# EAGLE design Pi1541_Rot (EAGLE 9.2.2)
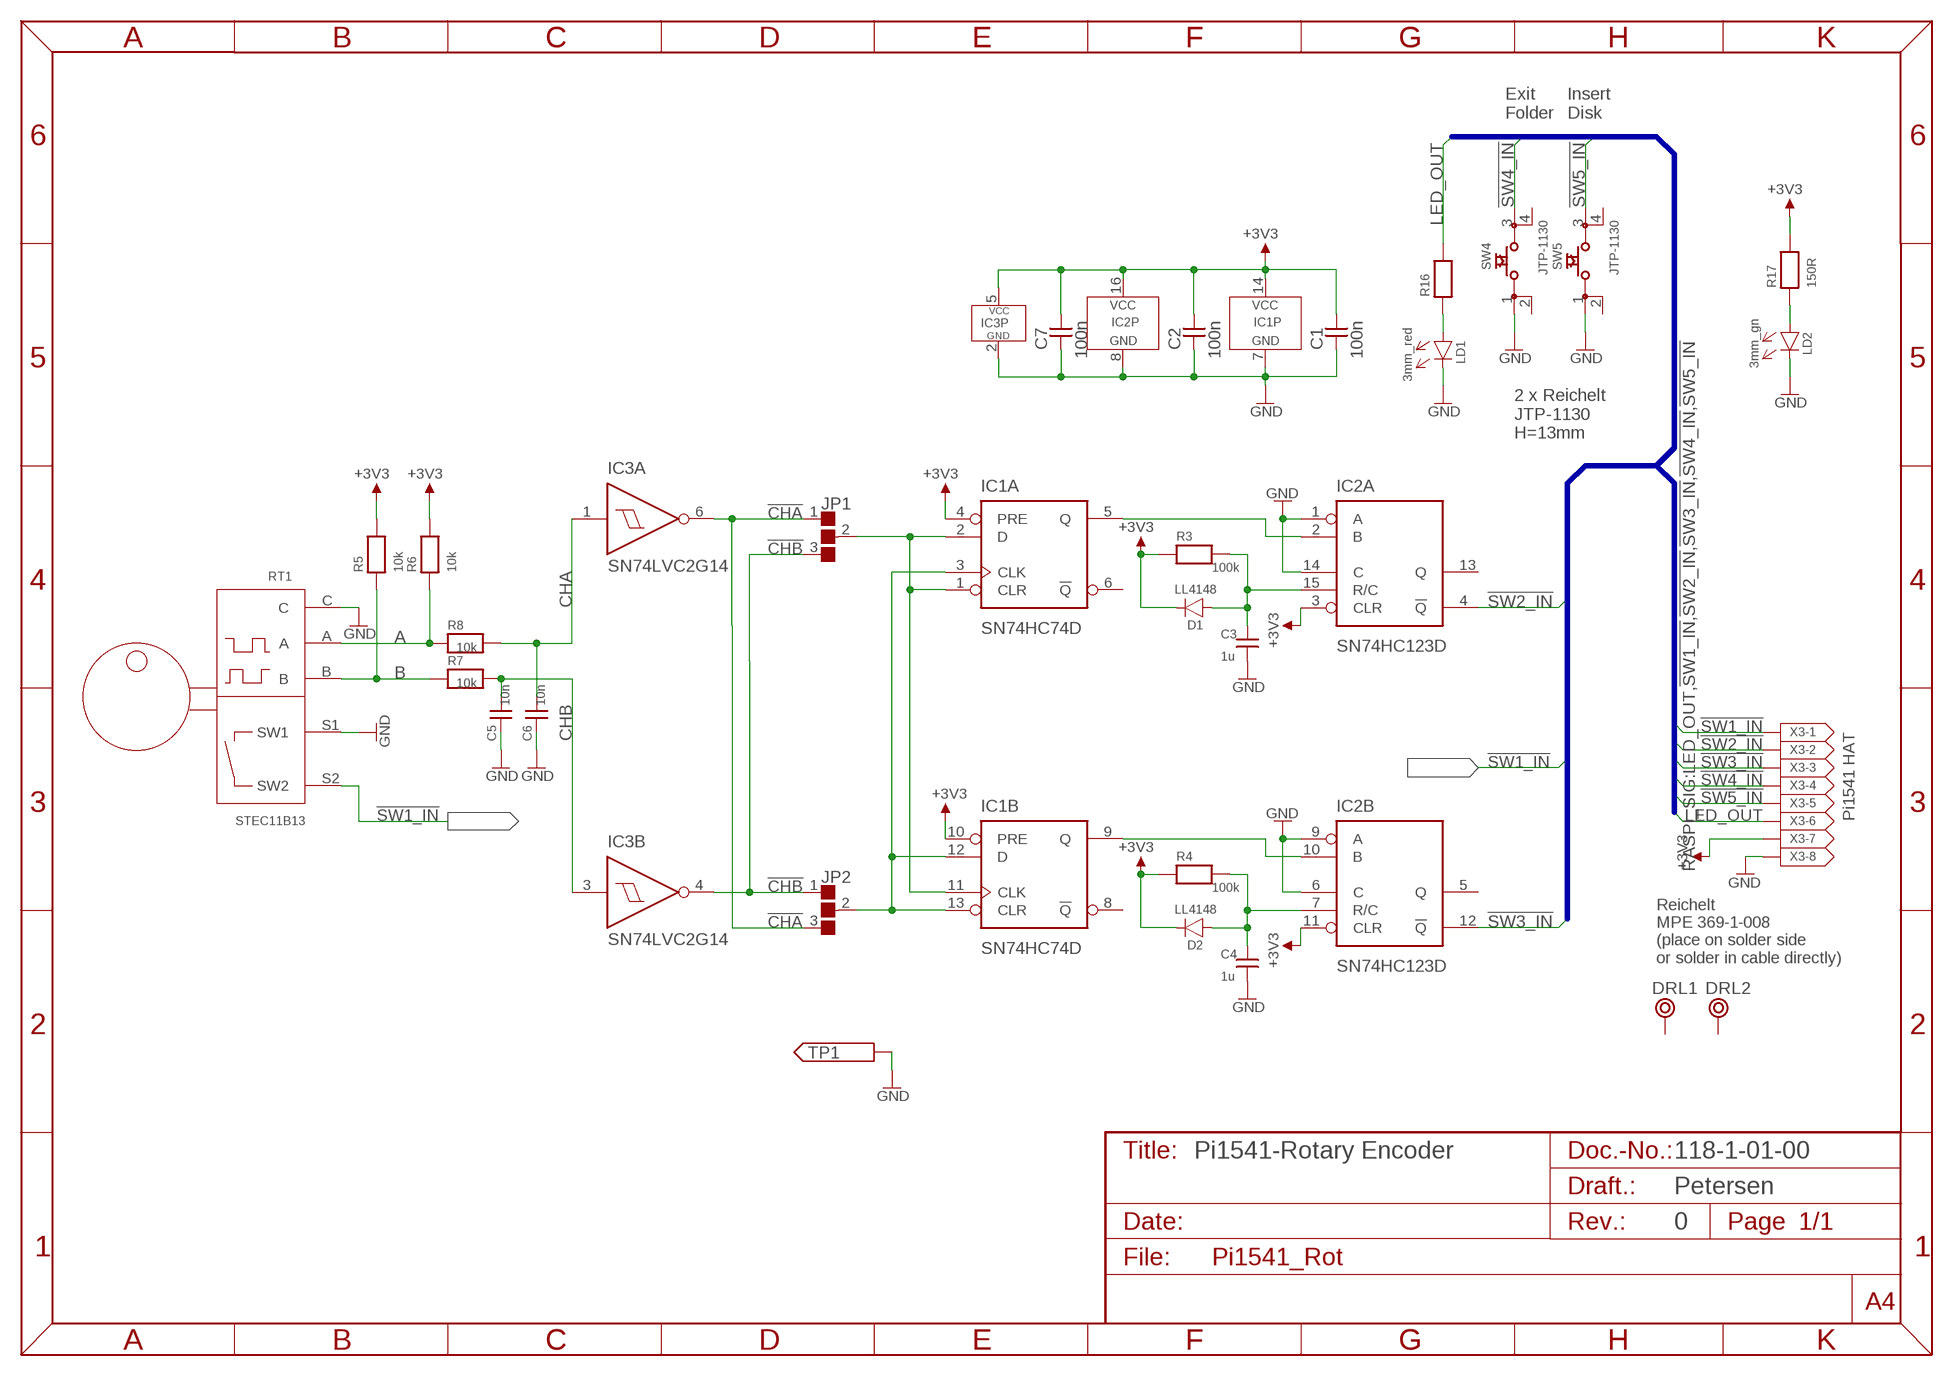
[diagram p0: schematic, sheet 1]
U$20 (OUT): SPICEPREFIX: X

## Parts
C1  100n  C-0805  [0805]
C2  100n  C-0805  [0805]
C3  1u  C-0805  [0805]
C4  1u  C-0805  [0805]
C5  10n  C-0805  [0805]
C6  10n  C-0805  [0805]
C7  100n  C-0805  [0805]
D1  LL4148  [SOD80C]
D2  LL4148  [SOD80C]
DRL1  BOHR2,8  [BOHR2,8_]
DRL2  BOHR2,8  [BOHR2,8_]
IC1  SN74HC74D  7474HC  [SO-14]
IC2  SN74HC123D  74123  [SO-16]
IC3  SN74LVC2G14  [SOT23-6]
JP1  JMP_0603  [CP3P]
JP2  JMP_0603  [CP3P]
LD1  3mm_red  3MM  [3MM]
LD2  3mm_gn  3MM  [3MM]
R3  100k  R-0805  [0805]
R4  100k  R-0805  [0805]
R5  10k  R-0805  [0805]
R6  10k  R-0805  [0805]
R7  10k  R-0805  [0805]
R8  10k  R-0805  [0805]
R16  150R  R-0805  [0805]
R17  150R  R-0805  [0805]
RT1  STEC11B13  [STEC11B13]
SW4  JTP-1130  [JTP-1130]
SW5  JTP-1130  [JTP-1130]
TP1  PAD1,0/AUTO  [1.0/AUTO]
X3  MICMA08B  [MICMA08B]

## Nets
!CHA: IC3.6(A:O) JP1.1 JP2.3
!CHB: IC3.4(B:O) JP1.3 JP2.1
!SW1_IN: RT1.S2(SW2) X3.1
!SW2_IN: IC2.4(A:!Q) X3.2
!SW3_IN: IC2.12(B:!Q) X3.3
!SW4_IN: SW4.3 X3.4
!SW5_IN: SW5.3 X3.5
+3V3: C1.2 C2.2 C7.2 D1.K D2.K IC1.4(A:PRE) IC1.10(B:PRE) IC1.14(P:VCC) IC2.3(A:CLR) IC2.11(B:CLR) IC2.16(P:VCC) IC3.5(P:VCC) R3.1 R4.1 R5.2 R6.2 R17.2 X3.7
A: R6.1 R8.1 RT1.A
B: R5.1 R7.1 RT1.B
CHA: C6.2 IC3.1(A:I) R8.2
CHB: C5.2 IC3.3(B:I) R7.2
GND: C1.1 C2.1 C3.2 C4.2 C5.1 C6.1 C7.1 IC1.7(P:GND) IC2.1(A:A) IC2.6(B:C) IC2.8(P:GND) IC2.9(B:A) IC2.14(A:C) IC3.2(P:GND) LD1.C(K) LD2.C(K) RT1.C RT1.S1(SW1) SW4.1 SW5.1 TP1.1 X3.8
LED_OUT: R16.2 X3.6
N$1: IC1.5(A:Q) IC2.2(A:B)
N$2: IC1.9(B:Q) IC2.10(B:B)
N$3: IC1.1(A:CLR) IC1.2(A:D) IC1.11(B:CLK) JP1.2
N$4: C3.1 D1.A IC2.15(A:R/C) R3.2
N$5: C4.1 D2.A IC2.7(B:R/C) R4.2
N$6: IC1.3(A:CLK) IC1.12(B:D) IC1.13(B:CLR) JP2.2
N$7: LD2.A R17.1
N$12: LD1.A R16.1
Unconnected: DRL1.MH DRL2.MH IC1.6(A:!Q) IC1.8(B:!Q) IC2.5(B:Q) IC2.13(A:Q) SW4.2 SW4.4 SW5.2 SW5.4

## Buses
RASPI_SIG:LED_OUT,!SW1_IN,!SW2_IN,!SW3_IN,!SW4_IN,!SW5_IN

## Notes on the sheet
- Exit
  Folder
- Insert
  Disk
- 2 x Reichelt
  JTP-1130
  H=13mm
- Pi1541 HAT
- Reichelt
  MPE 369-1-008
  (place on solder side
  or solder in cable directly)
- Pi1541-Rotary Encoder | 118-1-01-00
- Petersen
- 0

## Library data of the parts
C1-C7 = SMD:C-0805
D1 D2 = Dioden:LL4148
DRL1 DRL2 = Mech_Bohr:BOHR2,8
IC1 = 74XX:7474*: Dual D-Flip-Flop SO14
IC2 = 74XX:74123
IC3 = Texas_Instruments:SN74LVC2G14
JP1 JP2 = Cutpad:JMP_0603
LD1 LD2 = LED:3MM
R3-R8 R16 R17 = SMD:R-0805
RT1 = Alps:STEC11B13
SW4 SW5 = Namae_Electronics:JTP-1130
TP1 = Pads:PAD1,0/AUTO
X3 = AMP:MICMA08B

## Board
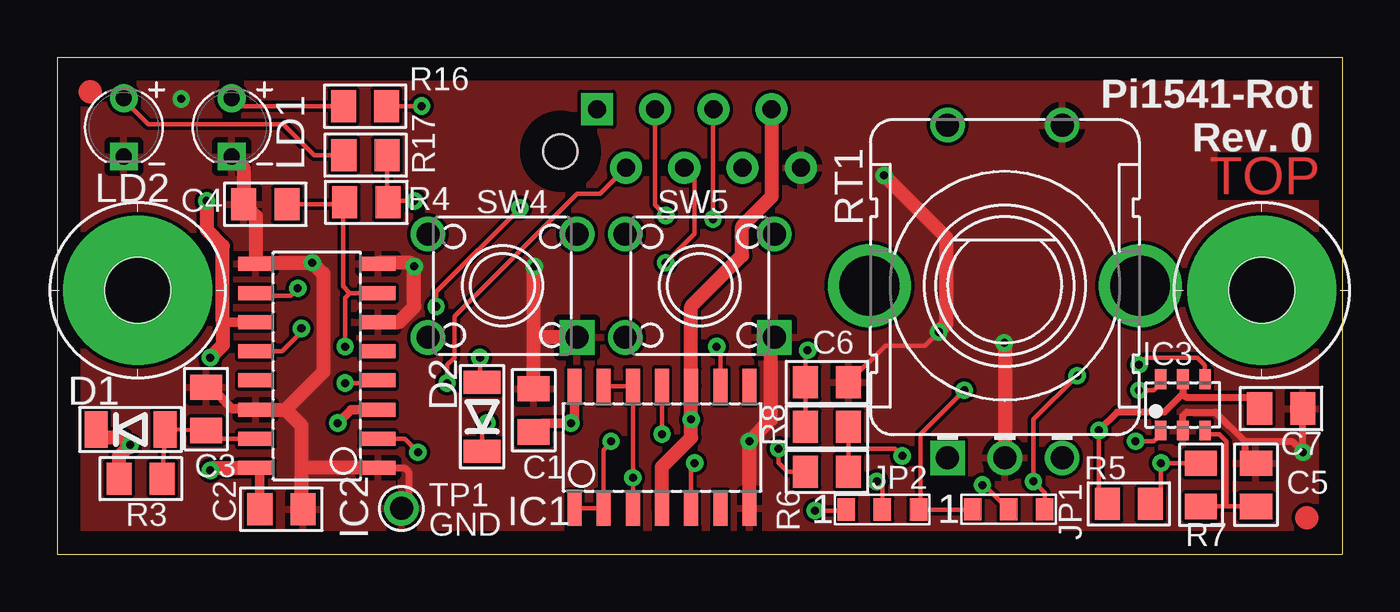
[diagram p1: board, top side]
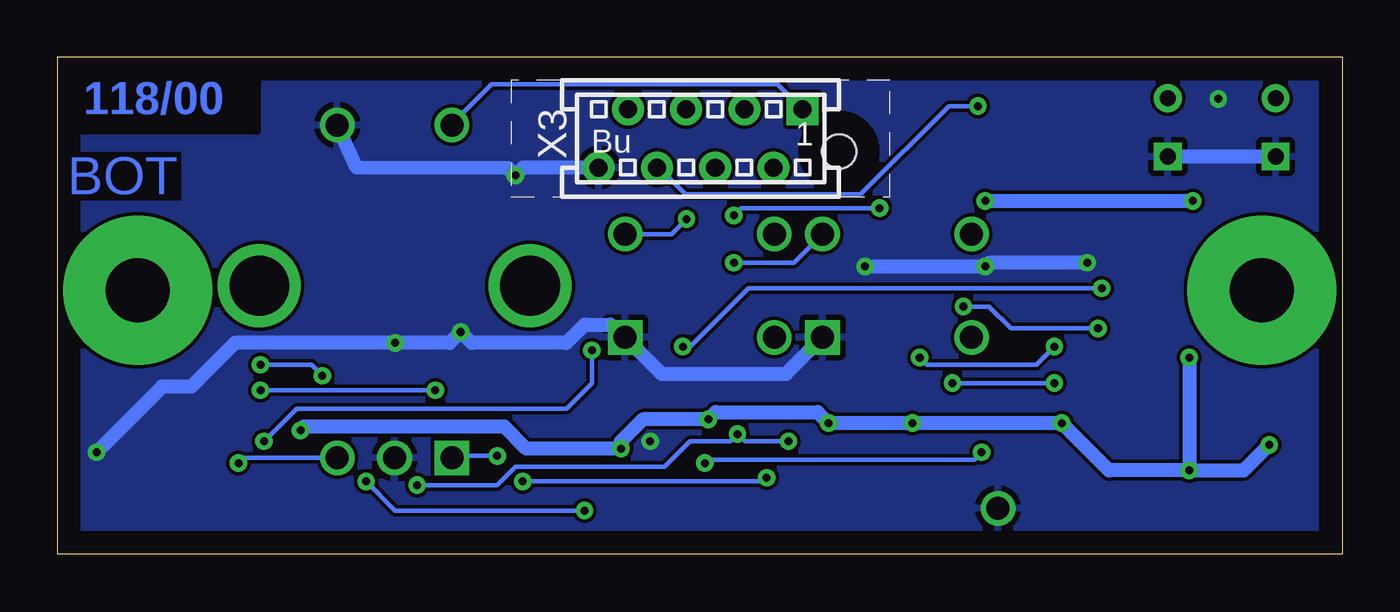
[diagram p2: board, bottom side, seen from below]

Size 56 x 21.65 mm. Coordinates in mm from the lower left corner, seen from the top.
Outline: 0,0 56,0 56,21.65 0,21.65 0,0
Copper layers (1*16): Top 0.035mm / dielectric 1.5mm / Bottom 0.035mm
Design rules "default *": minimum track width 6mil, minimum drill 0.35mm, track to track 6mil, track to pad 6mil, pad to pad 6mil, via to via 6mil, smd to smd 6mil, copper to edge 40mil, drill to drill 6mil, minimum pad ring 10mil, minimum via ring 8mil, stop-mask expansion 4mil, vias tented up to drill 0.5mm, thermal gap 10mil
bRestrict: 2 lines

### Footprints (pad centres in the part's own frame; a part is rotated, then mirrored left to right if it is on the bottom)
0805 = smd 1.092 x 1.397: 1 -0.94,0; 2 0.94,0
SOD80C = smd 1 x 1.6: A -1.5,0; K 1.5,0
BOHR2,8_ = drill 2.794 pad 6.502: MH 0,0
SO-14 = smd 0.61 x 1.524: 1 -3.81,-2.667; 2 -2.54,-2.667; 3 -1.27,-2.667; 4 0,-2.667; 5 1.27,-2.667; 6 2.54,-2.667; 7 3.81,-2.667; 8 3.81,2.667; 9 2.54,2.667; 10 1.27,2.667; 11 0,2.667; 12 -1.27,2.667; 13 -2.54,2.667; 14 -3.81,2.667
SO-16 = smd 0.61 x 1.524: 1 -4.445,-2.667; 2 -3.175,-2.667; 3 -1.905,-2.667; 4 -0.635,-2.667; 5 0.635,-2.667; 6 1.905,-2.667; 7 3.175,-2.667; 8 4.445,-2.667; 9 4.445,2.667; 10 3.175,2.667; 11 1.905,2.667; 12 0.635,2.667; 13 -0.635,2.667; 14 -1.905,2.667; 15 -3.175,2.667; 16 -4.445,2.667
SOT23-6 = smd 0.508 x 0.864: 1 -0.965,-1.118; 2 0,-1.118; 3 0.965,-1.118; 4 0.965,1.118; 5 0,1.118; 6 -0.965,1.118
CP3P = smd 0.762 x 0.965: 1 -1.575,0; 2 0,0; 3 1.575,0
3MM = drill 0.7: A -1.27,0 | drill 0.7 square: C 1.27,0
STEC11B13 = drill 1 square: A -2.5,-7.5 | drill 1: B 2.5,-7.5; C 0,-7.5; S1 2.5,7; S2 -2.5,7 | drill 2.6: LG1 -5.9,0; LG2 5.9,0
JTP-1130 = drill 1 square: 1 3.25,-2.25 | drill 1: 2 -3.25,-2.25; 3 3.25,2.25; 4 -3.25,2.25
1.0/AUTO = drill 1: 1 0,0
MICMA08B = drill 0.787 pad 1.397 square: 1 4.445,1.27 | drill 0.787 pad 1.397: 2 3.175,-1.27; 3 1.905,1.27; 4 0.635,-1.27; 5 -0.635,1.27; 6 -1.905,-1.27; 7 -3.175,1.27; 8 -4.445,-1.27 | hole 1.5: 6.032,-0.568

### Placement (x,y rotation side)
C1  20.76,6.27 270 top
C2  9.77,1.96 180 top
C3  6.48,6.33 90 top
C4  9.07,15.25 180 top
C5  52.25,3.02 270 top
C6  33.55,7.49 180 top
C7  53.34,6.35 180 top
D1  3.19,5.44 180 top
D2  18.51,5.99 270 top
DRL1  3.5,11.5 0 top
DRL2  52.5,11.5 0 top
IC1  26.36,4.66 0 top
IC2  11.31,8.21 90 top
IC3  49.05,6.51 0 top
JP1  41.46,1.96 0 top
JP2  35.96,1.95 0 top
LD1  7.6,18.6 270 top
LD2  2.9,18.6 270 top
R3  3.63,3.29 0 top
R4  13.47,15.33 180 top
R5  46.71,2.2 180 top
R6  33.55,3.6 180 top
R7  49.85,3.02 270 top
R8  33.55,5.55 180 top
R16  13.41,19.52 0 top
R17  13.43,17.39 0 top
RT1  41.3,11.7 0 top
SW4  19.4,11.7 0 top
SW5  28,11.7 0 top
TP1  15,2 0 top
U$23  [SMD_REF_R1MM]  54.45,1.59 0 top
U$24  [SMD_REF_R1MM]  1.43,20.16 0 top
U$44  [2LAYER]  55.05,17.34 180 top
U$45  [PCB-TITLE/]  -0.16,39.74 0 top  (outside the outline)
X3  27.96,18.12 0 bottom

### Tracks (layer width: path | path; a pad name or v marks a point on that pad's centre or on a via)
!CHA  (via drill 0.35)
  Top 0.203: JP2.3 37.62,1.95 | 37.62,1.95 38.58,1.95 39.88,1.95 JP1.1 | IC3.6 47.94,7.48 47.94,7.3 47.78,7.14 v47.15,7.14 | v39.53,7.14 37.62,5.24 37.62,1.95
  Bottom 0.203: v47.15,7.14 v39.53,7.14
!CHB  (via drill 0.35)
  Top 0.203: JP1.3 43.04,2.68 v42.55,3.17 42.55,5.08 42.55,5.87 v44.45,7.78 | v33.02,1.91 34.34,1.91 JP2.1 | IC3.4 50.02,8.24 49.69,8.57 47.47,8.57 v47.15,8.26
  Bottom 0.203: v42.55,3.17 41.27,1.91 40.8,1.91 40.01,1.91 33.18,1.91 v33.02,1.91 | v47.15,8.26 44.93,8.26 v44.45,7.78
!SW1_IN
  Bottom 0.2: 37.07,20.48 38.8,18.75 RT1.S2
  Bottom 0.203: X3.1 24.6,20.48 37.07,20.48
!SW2_IN  (via drill 0.35)
  Top 0.203: X3.2 23.65,15.72 22.64,15.72 17.3,10.38 17.3,8.57 16.99,8.26 v16.99,7.46 | IC2.4 13.87,7.46 v12.54,7.46
  Bottom 0.203: v16.99,7.46 v12.54,7.46
!SW3_IN  (via drill 0.35)
  Top 0.203: IC2.12 9.79,8.84 10.64,9.68 v10.64,9.84 | v26.51,14.76 26.05,15.22 X3.3 | v20.16,15.08 16.51,11.43 16.51,10.95 v16.51,10.79
  Bottom 0.203: v26.51,14.76 26.19,15.08 v20.16,15.08 | v16.51,10.79 15.4,10.79 14.45,9.84 v10.64,9.84
!SW4_IN  (via drill 0.35)
  Top 0.203: X3.4 27.78,16.39 27.78,15.72 27.78,13.97 v26.51,12.7
  Bottom 0.203: v26.51,12.7 23.9,12.7 SW4.3
!SW5_IN  (via drill 0.35)
  Top 0.203: X3.5 28.57,19.37 v28.57,14.61
  Bottom 0.203: v28.57,14.61 29.23,13.95 SW5.3
+3V3  (via drill 0.35)
  Top 0.203: R17.2 14.37,15.37 R4.1 14.48,15.4 v15.56,15.4 | R6.2 31.82,3.6 31.43,3.98 v31.43,4.6 | D2.K 18.51,5.5 v18.73,5.71 | v45.4,5.4 45.4,2.56 R5.2 | 1.91,5.08 1.91,5.22 D1.K
  Top 0.305: IC3.5 49.05,6.99 | v45.4,5.4 46.2,6.19 48.26,6.19 49.05,6.99 | C7.2 52.4,6.66 52.23,6.83 49.21,6.83 49.05,6.99
  Top 0.406: IC2.11 7.26,10.11 7.21,10.16 | C2.2 8.83,3.58 IC2.16 | C1.2 21.14,5.71 v22.38,5.71 22.55,5.88 IC1.14 | IC2.3 12.81,6.3 v12.22,5.71
  Top 0.61: v6.51,15.4 6.51,14.13 7.21,13.43 7.21,10.16 7.21,9.11 v6.67,8.57 | 1.91,5.08 2.86,5.08 v3.17,4.76 2.69,4.28 R3.1 | v6.67,3.65 arc-90 6.78,3.76 IC2.16 | IC1.4 26.36,3.81 27.62,5.08 v27.62,5.87 IC1.10 27.62,10.8 29.84,13.02 29.84,14.29 31.14,15.58 X3.7
  Bottom 0.61: v15.56,15.4 v6.51,15.4 | v6.67,8.57 v6.67,3.65 | v6.67,3.65 4.29,3.65 v3.17,4.76 | v6.67,3.65 10.16,3.65 v12.22,5.71 v18.73,5.71 v22.38,5.71 22.86,6.19 27.3,6.19 v27.62,5.87 30.48,5.87 31.43,4.92 v31.43,4.6 35.56,4.6 36.51,5.56 45.24,5.56 v45.4,5.4
A  (via drill 0.35)
  Top 0.203: R8.1 34.49,4.6 | 34.49,4.6 R6.1 | v36.83,4.29 36.51,4.6 34.49,4.6
  Bottom 0.203: v36.83,4.29 38.71,4.29 RT1.A
B  (via drill 0.35)
  Top 0.203: R5.1 48.1,2.65 v48.1,3.97 v48.11,3.96 R7.1
  Bottom 0.203: RT1.B 47.87,4.2 v48.1,3.97
CHA  (via drill 0.35)
  Top 0.2: 32.6,5.87 32.61,5.88 C6.2
  Top 0.203: R8.2 32.61,5.71 32.6,5.71 32.6,5.87 | C6.2 32.61,8.8 v32.7,8.89 | IC3.1 47.94,5.25 47.94,5.08 47.78,4.92 v46.99,4.92
  Bottom 0.203: v46.99,4.92 45.56,6.35 33.81,6.35 32.7,7.46 v32.7,8.89
CHB
  Top 0.203: C5.2 50.96,2.08 | 50.96,2.08 R7.2 | IC3.3 50.17,5.24 50.64,5.24 50.96,4.92 50.96,2.08
GND  (via drill 0.35)
  Top 0.203: C6.1 36.09,9.09 37.82,9.09 v38.42,9.68 | C5.1 52.25,4.14 | v54.29,4.45 v54.28,4.46 | C5.1 | 51.75,3.97 51.76,3.96 C5.1
  Top 0.305: TP1.1 15.3,2.3 15.3,3.59 15.13,3.76 IC2.1 | v54.28,4.46 C7.1 | IC3.2 49.05,6.03 49.21,6.19 50.48,6.19 51.75,4.92 | 51.75,4.92 51.75,3.97 | 51.75,4.92 53.82,4.92 v54.29,4.45 | v30.16,4.92
  Top 0.406: IC2.14 8.6,6.35 7.62,6.35 6.7,7.27 C3.2
  Top 0.61: LD1.C 8.13,16.8 C4.2 8.65,14.73 IC2.9 8.69,12.7 v11.11,12.7 11.59,12.22 11.59,7.94 9.95,6.3 | IC2.8 14.03,12.7 15.4,12.7 v15.56,12.54 15.56,10.79 14.88,10.11 IC2.6 | C1.1 20.76,9.37 | 20.76,9.37 20.76,12.5 v20.8,12.54 | IC2.14 9.95,6.3 | 9.95,6.3 10.64,5.62 10.64,3.65 | C2.1 10.64,2.03 10.64,3.65 | IC2.1 12.22,3.76 10.75,3.76 10.64,3.65 | SW4.1 20.84,9.45 20.76,9.37 | v41.27,9.21 41.3,9.18 RT1.C | v38.42,9.68 38.73,10 38.73,13.81 v36.04,16.51 | IC1.7 v30.16,4.92 31.11,5.87 31.11,9.31 SW5.1
  Bottom 0.61: X3.8 35.7,16.85 v36.04,16.51 36.35,16.83 42.95,16.85 RT1.S1 | LD2.C LD1.C | v11.11,12.7 15.4,12.7 v15.56,12.54 v20.8,12.54 | SW4.1 24.24,7.86 29.66,7.86 SW5.1 31.41,9.29 31.41,9.5 31.91,10 33.02,10 33.81,9.21 37.94,9.21 v38.42,9.68 38.89,9.21 v41.27,9.21 48.26,9.21 49.85,7.62 50.16,7.3 51.44,7.3 v54.29,4.45
  other vias: 5.4,19.84
  pour Top: 0.48,21.29 0.48,0.5 55.56,0.5 55.56,21.29
  pour Bottom: 0.48,21.29 55.56,21.29 55.56,0.5 0.48,0.5
LED_OUT  (via drill 0.35)
  Top 0.203: v15.88,19.53 R16.2
  Bottom 0.203: X3.6 29.78,16.85 29.17,16.23 28.62,15.69 20.99,15.69 17.14,19.53 v15.88,19.53
N$1  (via drill 0.35)
  Top 0.203: IC1.5 27.62,3.81 v27.78,3.97 | v15.72,4.45 15.13,5.03 IC2.2
  Bottom 0.203: v27.78,3.97 27.62,4.13 26.35,4.13 16.03,4.13 v15.72,4.45
N$2  (via drill 0.35)
  Top 0.203: v10.48,11.59 10.16,11.27 8.73,11.27 8.65,11.36 IC2.10 | IC1.9 28.89,8.89 v28.73,9.05
  Bottom 0.203: v28.73,9.05 28.42,9.05 25.88,11.59 25.08,11.59 23.02,11.59 v10.48,11.59
N$3  (via drill 0.35)
  Top 0.203: JP1.2 40.41,3.02 v40.32,3.02 | IC1.1 IC1.2 23.82,4.53 24.13,4.85 v24.13,4.92 | IC1.11 v26.35,5.24
  Bottom 0.203: v40.32,3.02 36.83,3.02 36.04,3.81 32.7,3.81 29.53,3.81 28.42,4.92 26.67,4.92 v26.35,5.24 26.04,4.92 v24.13,4.92
N$4
  Top 0.203: R3.2 D1.A C3.1 arc90 6.84,5.03 IC2.15
N$5  (via drill 0.35)
  Top 0.203: C4.1 12.45,15.25 | 12.45,15.25 R4.2 | 12.45,15.25 12.45,11.68 12.75,11.38 | 12.75,11.38 IC2.7 | D2.A 18.41,7.59 v18.41,8.57 | v12.54,9.05 12.54,11.18 12.75,11.38
  Bottom 0.203: v18.41,8.57 18.1,8.26 13.34,8.26 v12.54,9.05
N$6  (via drill 0.35)
  Top 0.203: JP2.2 35.96,2.93 v35.72,3.17 | IC1.3 v25.08,3.33 v25.09,3.34 25.09,7.3 | IC1.12 25.09,7.3 | IC1.13 25.06,7.33 25.09,7.3
  Bottom 0.203: v35.72,3.17 29.84,3.17 25.24,3.17 v25.08,3.33
N$7
  Top 0.203: R17.1 11.18,17.39 9.84,18.73 3.97,18.73 2.9,19.8 LD2.A
N$12
  Top 0.203: R16.1 7.95,19.52 LD1.A

### Text on the board
Bottom: 118/00
tPlace: Pi1541-Rot / Rev. 0 | GND
Measures: 2.8
Document: 118-2-01-00 | Sven Petersen / 2019 | 35µm | 2 | 0